# EAGLE schematic hex&bin eeprom display (EAGLE 9.5.1)
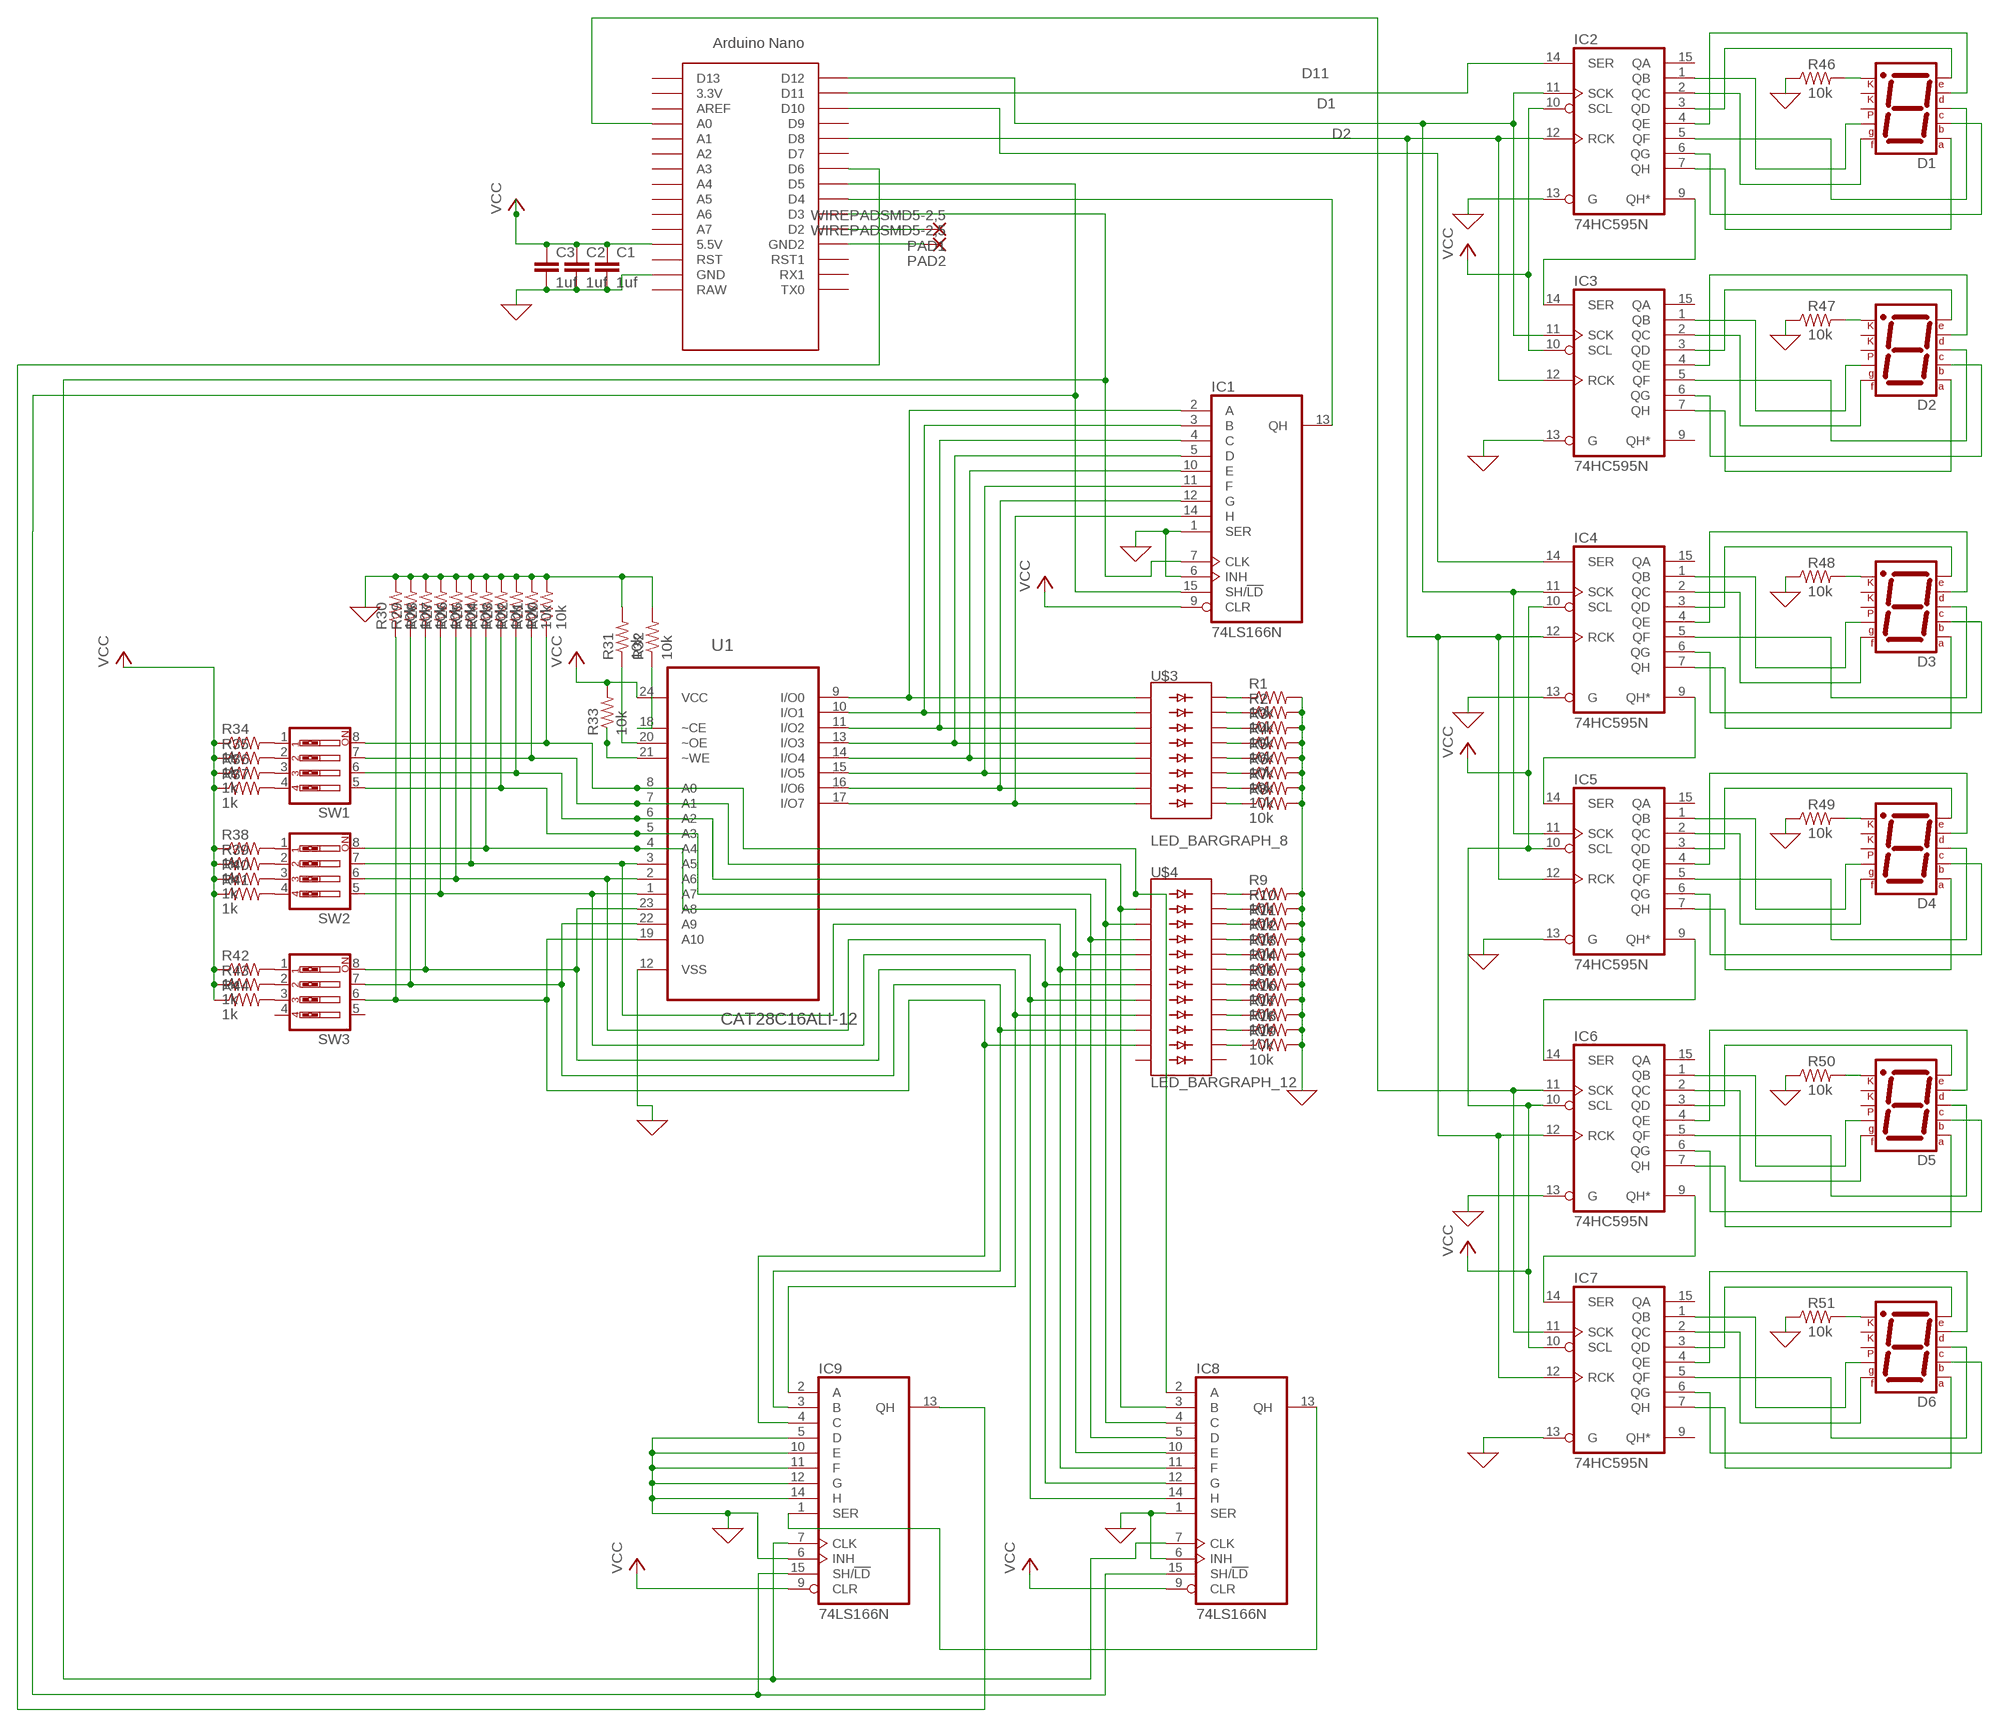
[diagram p0: schematic, sheet 1]

## Parts
C1  1uf  C5/3  [C5B3]
C2  1uf  C5/3  [C5B3]
C3  1uf  C5/3  [C5B3]
D1  7SEG-CK  [7SEG-13]
D2  7SEG-CK  [7SEG-13]
D3  7SEG-CK  [7SEG-13]
D4  7SEG-CK  [7SEG-13]
D5  7SEG-CK  [7SEG-13]
D6  7SEG-CK  [7SEG-13]
IC1  74LS166N  [DIL16]
IC2  74HC595N  [DIL16]
IC3  74HC595N  [DIL16]
IC4  74HC595N  [DIL16]
IC5  74HC595N  [DIL16]
IC6  74HC595N  [DIL16]
IC7  74HC595N  [DIL16]
IC8  74LS166N  [DIL16]
IC9  74LS166N  [DIL16]
PAD1  WIREPADSMD5-2,5  [5-2,5]
PAD2  WIREPADSMD5-2,5  [5-2,5]
R1  10k  R-US_0204/7  [0204/7]
R2  10k  R-US_0204/7  [0204/7]
R3  10k  R-US_0204/7  [0204/7]
R4  10k  R-US_0204/7  [0204/7]
R5  10k  R-US_0204/7  [0204/7]
R6  10k  R-US_0204/7  [0204/7]
R7  10k  R-US_0204/7  [0204/7]
R8  10k  R-US_0204/7  [0204/7]
R9  10k  R-US_0204/7  [0204/7]
R10  10k  R-US_0204/7  [0204/7]
R11  10k  R-US_0204/7  [0204/7]
R12  10k  R-US_0204/7  [0204/7]
R13  10k  R-US_0204/7  [0204/7]
R14  10k  R-US_0204/7  [0204/7]
R15  10k  R-US_0204/7  [0204/7]
R16  10k  R-US_0204/7  [0204/7]
R17  10k  R-US_0204/7  [0204/7]
R18  10k  R-US_0204/7  [0204/7]
R19  10k  R-US_0204/7  [0204/7]
R20  10k  R-US_0204/7  [0204/7]
R21  10k  R-US_0204/7  [0204/7]
R22  10k  R-US_0204/7  [0204/7]
R23  10k  R-US_0204/7  [0204/7]
R24  10k  R-US_0204/7  [0204/7]
R25  10k  R-US_0204/7  [0204/7]
R26  10k  R-US_0204/7  [0204/7]
R27  10k  R-US_0204/7  [0204/7]
R28  10k  R-US_0204/7  [0204/7]
R29  10k  R-US_0204/7  [0204/7]
R30  10k  R-US_0204/7  [0204/7]
R31  10k  R-US_0204/7  [0204/7]
R32  10k  R-US_0204/7  [0204/7]
R33  10k  R-US_0204/7  [0204/7]
R34  1k  R-US_0204/7  [0204/7]
R35  1k  R-US_0204/7  [0204/7]
R36  1k  R-US_0204/7  [0204/7]
R37  1k  R-US_0204/7  [0204/7]
R38  1k  R-US_0204/7  [0204/7]
R39  1k  R-US_0204/7  [0204/7]
R40  1k  R-US_0204/7  [0204/7]
R41  1k  R-US_0204/7  [0204/7]
R42  1k  R-US_0204/7  [0204/7]
R43  1k  R-US_0204/7  [0204/7]
R44  1k  R-US_0204/7  [0204/7]
R46  10k  R-US_0204/7  [0204/7]
R47  10k  R-US_0204/7  [0204/7]
R48  10k  R-US_0204/7  [0204/7]
R49  10k  R-US_0204/7  [0204/7]
R50  10k  R-US_0204/7  [0204/7]
R51  10k  R-US_0204/7  [0204/7]
SW1  SW_DIP-4  [EDG-04]
SW2  SW_DIP-4  [EDG-04]
SW3  SW_DIP-4  [EDG-04]
U1  CAT28C16ALI-12  [DIP254P1524X635-24]
U$1  NANO  [NANO]
U$3  LED_BARGRAPH_8  [LED_BARGRAPH_8]
U$4  LED_BARGRAPH_12  [LED_BARGRAPH_12]

## Nets
0: C1.2 C2.2 C3.2 IC1.1(SER) IC1.6(INH) IC2.13(G) IC3.13(G) IC4.13(G) IC5.13(G) IC6.13(G) IC7.13(G) IC8.1(SER) IC8.6(INH) IC9.5(D) IC9.6(INH) IC9.10(E) IC9.11(F) IC9.12(G) IC9.14(H) R1.2 R2.2 R3.2 R4.2 R5.2 R6.2 R7.2 R8.2 R9.2 R10.2 R11.2 R12.2 R13.2 R14.2 R15.2 R16.2 R17.2 R18.2 R19.2 R20.2 R21.2 R22.2 R23.2 R24.2 R25.2 R26.2 R27.2 R28.2 R29.2 R30.2 R31.2 R32.2 R46.1 R47.1 R48.1 R49.1 R50.1 R51.1 U1.12(VSS) U$1.GND ; supply symbol labelled GND
D1: IC2.11(SCK) IC3.11(SCK) IC4.11(SCK) IC5.11(SCK) U$1.D12
D2: IC2.12(RCK) IC3.12(RCK) IC4.12(RCK) IC5.12(RCK) IC6.12(RCK) IC7.12(RCK) U$1.D8
D3: IC1.7(CLK) IC8.7(CLK) IC9.7(CLK) U$1.D3
D4: IC1.13(QH) U$1.D4
D5: IC1.15(SH/!LD) IC8.15(SH/!LD) IC9.15(SH/!LD) U$1.D5
D6: IC4.14(SER) U$1.D10
D10: IC5.9(QH*) IC6.14(SER)
D11: IC2.14(SER) U$1.D11
N$1: D1.10(G) IC2.1(QB)
N$2: R1.1 U$3.16(C)
N$3: R2.1 U$3.15(C1)
N$4: R3.1 U$3.14(C2)
N$5: R4.1 U$3.13(C3)
N$6: R5.1 U$3.12(C4)
N$7: R6.1 U$3.11(C5)
N$8: R7.1 U$3.10(C6)
N$9: R8.1 U$3.9(C7)
N$10: R9.1 U$4.24(C)
N$11: R10.1 U$4.23(C1)
N$12: R11.1 U$4.22(C2)
N$13: R12.1 U$4.21(C3)
N$14: R13.1 U$4.20(C4)
N$15: R14.1 U$4.19(C5)
N$16: R15.1 U$4.18(C6)
N$17: R16.1 U$4.17(C7)
N$18: R17.1 U$4.16(C8)
N$19: R18.1 U$4.15(C9)
N$20: R19.1 U$4.14(C10)
N$21: D1.9(F) IC2.2(QC)
N$22: R33.1 U1.21(~WE)
N$23: D1.1(E) IC2.3(QD)
N$24: R31.1 U1.20(~OE)
N$25: R32.1 U1.18(~CE)
N$26: R38.2 SW2.1
N$27: R39.2 SW2.2
N$28: R40.2 SW2.3
N$29: R41.2 SW2.4
N$30: R34.2 SW1.1
N$31: R35.2 SW1.2
N$32: R36.2 SW1.3
N$33: D5.10(G) IC6.1(QB)
N$34: D3.10(G) IC4.1(QB)
N$35: D3.9(F) IC4.2(QC)
N$36: D3.1(E) IC4.3(QD)
N$37: D3.2(D) IC4.4(QE)
N$38: D3.6(B) IC4.6(QG)
N$39: D3.4(C) IC4.5(QF)
N$40: D3.7(A) IC4.7(QH)
N$41: IC8.2(A) R20.1 SW1.8 U1.8(A0) U$4.1(A)
N$42: IC8.3(B) R21.1 SW1.7 U1.7(A1) U$4.2(A1)
N$43: IC8.4(C) R22.1 SW1.6 U1.6(A2) U$4.3(A2)
N$44: IC8.5(D) R23.1 SW1.5 U1.5(A3) U$4.4(A3)
N$45: IC8.10(E) R24.1 SW2.8 U1.4(A4) U$4.5(A4)
N$46: IC8.11(F) R25.1 SW2.7 U1.3(A5) U$4.6(A5)
N$47: IC8.12(G) R26.1 SW2.6 U1.2(A6) U$4.7(A6)
N$48: IC8.14(H) R27.1 SW2.5 U1.1(A7) U$4.8(A7)
N$49: IC9.2(A) R28.1 SW3.8 U1.23(A8) U$4.9(A8)
N$50: IC9.3(B) R29.1 SW3.7 U1.22(A9) U$4.10(A9)
N$51: IC9.4(C) R30.1 SW3.6 U1.19(A10) U$4.11(A10)
N$52: R37.2 SW1.4
N$53: R42.2 SW3.1
N$54: R43.2 SW3.2
N$55: PAD1.1(P) U$1.D2
N$56: PAD2.1(P) U$1.GND1(GND2)
N$57: D1.2(D) IC2.4(QE)
N$58: D1.6(B) IC2.6(QG)
N$59: D1.4(C) IC2.5(QF)
N$60: D1.7(A) IC2.7(QH)
N$61: D1.8(CK2) R46.2
N$62: D2.10(G) IC3.1(QB)
N$63: D2.9(F) IC3.2(QC)
N$64: D2.1(E) IC3.3(QD)
N$65: D2.2(D) IC3.4(QE)
N$66: D2.6(B) IC3.6(QG)
N$67: D2.4(C) IC3.5(QF)
N$68: D2.7(A) IC3.7(QH)
N$69: D2.8(CK2) R47.2
N$70: IC2.9(QH*) IC3.14(SER)
N$71: IC1.10(E) U1.14(I/O4) U$3.5(A4)
N$72: IC1.11(F) U1.15(I/O5) U$3.6(A5)
N$73: IC1.12(G) U1.16(I/O6) U$3.7(A6)
N$74: IC1.14(H) U1.17(I/O7) U$3.8(A7)
N$75: IC1.2(A) U1.9(I/O0) U$3.1(A)
N$76: D3.8(CK2) R48.2
N$77: D4.10(G) IC5.1(QB)
N$78: D4.9(F) IC5.2(QC)
N$79: IC1.3(B) U1.10(I/O1) U$3.2(A1)
N$80: IC1.4(C) U1.11(I/O2) U$3.3(A2)
N$81: IC1.5(D) U1.13(I/O3) U$3.4(A3)
N$82: D4.1(E) IC5.3(QD)
N$83: D4.2(D) IC5.4(QE)
N$84: D4.6(B) IC5.6(QG)
N$85: D4.4(C) IC5.5(QF)
N$86: D4.7(A) IC5.7(QH)
N$87: D4.8(CK2) R49.2
N$88: IC4.9(QH*) IC5.14(SER)
N$89: D5.9(F) IC6.2(QC)
N$90: D5.1(E) IC6.3(QD)
N$91: D5.2(D) IC6.4(QE)
N$92: D5.6(B) IC6.6(QG)
N$93: D5.4(C) IC6.5(QF)
N$94: D5.7(A) IC6.7(QH)
N$95: D5.8(CK2) R50.2
N$96: D6.10(G) IC7.1(QB)
N$97: D6.9(F) IC7.2(QC)
N$98: D6.1(E) IC7.3(QD)
N$99: D6.2(D) IC7.4(QE)
N$100: D6.6(B) IC7.6(QG)
N$101: D6.4(C) IC7.5(QF)
N$102: D6.7(A) IC7.7(QH)
N$103: D6.8(CK2) R51.2
N$104: IC6.9(QH*) IC7.14(SER)
N$105: IC8.13(QH) IC9.1(SER)
N$106: IC6.11(SCK) IC7.11(SCK) U$1.A0
N$108: R44.2 SW3.3
N$111: IC9.13(QH) U$1.D6
VCC: C1.1 C2.1 C3.1 IC1.9(CLR) IC2.10(SCL) IC3.10(SCL) IC4.10(SCL) IC5.10(SCL) IC6.10(SCL) IC7.10(SCL) IC8.9(CLR) IC9.9(CLR) R33.2 R34.1 R35.1 R36.1 R37.1 R38.1 R39.1 R40.1 R41.1 R42.1 R43.1 R44.1 U1.24(VCC) U$1.5V(5.5V)
Unconnected: D1.3(CK1) D1.5(DP) D2.3(CK1) D2.5(DP) D3.3(CK1) D3.5(DP) D4.3(CK1) D4.5(DP) D5.3(CK1) D5.5(DP) D6.3(CK1) D6.5(DP) IC2.15(QA) IC3.9(QH*) IC3.15(QA) IC4.15(QA) IC5.15(QA) IC6.15(QA) IC7.9(QH*) IC7.15(QA) SW3.4 SW3.5 U$1.3.3V U$1.A1 U$1.A2 U$1.A3 U$1.A4 U$1.A5 U$1.A6 U$1.A7 U$1.AREF U$1.D7 U$1.D9 U$1.D13 U$1.ICSP1 U$1.ICSP2 U$1.ICSP3 U$1.ICSP4 U$1.ICSP5 U$1.ICSP6 U$1.RAW U$1.RST U$1.RST1 U$1.RX1 U$1.TX0 U$4.12(A11) U$4.13(C11)

## Power pins joined to a net without a drawn wire
GND: IC1.8(GND) IC2.8(GND) IC3.8(GND) IC4.8(GND) IC5.8(GND) IC6.8(GND) IC7.8(GND) IC8.8(GND) IC9.8(GND)
VCC: IC1.16(VCC) IC2.16(VCC) IC3.16(VCC) IC4.16(VCC) IC5.16(VCC) IC6.16(VCC) IC7.16(VCC) IC8.16(VCC) IC9.16(VCC)

## Library data of the parts
C1-C3 = capacitor-wima:C: CAPACITOR naming: grid - package width
D1-D6 = special:7SEG-CK: 7-segment DISPLAY single cathode, 13 mm
IC1 IC8 IC9 = 74xx-eu:74*166: 8-bit parallel load SHIFT REGISTER
IC2-IC7 = 74xx-eu:74*595: 8-bit SHIFT REGISTER, output latch
PAD1 PAD2 = wirepad:WIREPAD: Wire PAD connect wire on PCB
R1-R44 R46-R51 = adafruit:R-US_: RESISTOR, American symbol
SW1-SW3 = special:SW_DIP-4: DIP SWITCH
U1 = CAT28C16ALI-12:CAT28C16ALI-12: 16 kb CMOS Parallel EEPROM Check availability <https://pricing.snapeda.com/parts/CAT28C16ALI12/ON%20Semiconductor/view-part?ref=eda>; AVAILABILITY: In Stock; DESCRIPTION: EEPROM Memory IC 16Kb (2K x 8) Parallel 120 ns 24-PDIP; MF: ON Semiconductor; MP: CAT28C16ALI12; PACKAGE: PDIP-24 Catalyst Semiconductor; PRICE: None; PURCHASE-URL: https://pricing.snapeda.com/search/part/CAT28C16ALI12/?ref=eda
U$1 = Arduino-clone:NANO: Arduino Nano
U$3 = SparkFun-LED:LED_BARGRAPH_8
U$4 = SparkFun-LED:LED_BARGRAPH_12

## Net classes
0 default: width 0.508 mm